# EAGLE design IV-18_test (EAGLE 6.6.0)
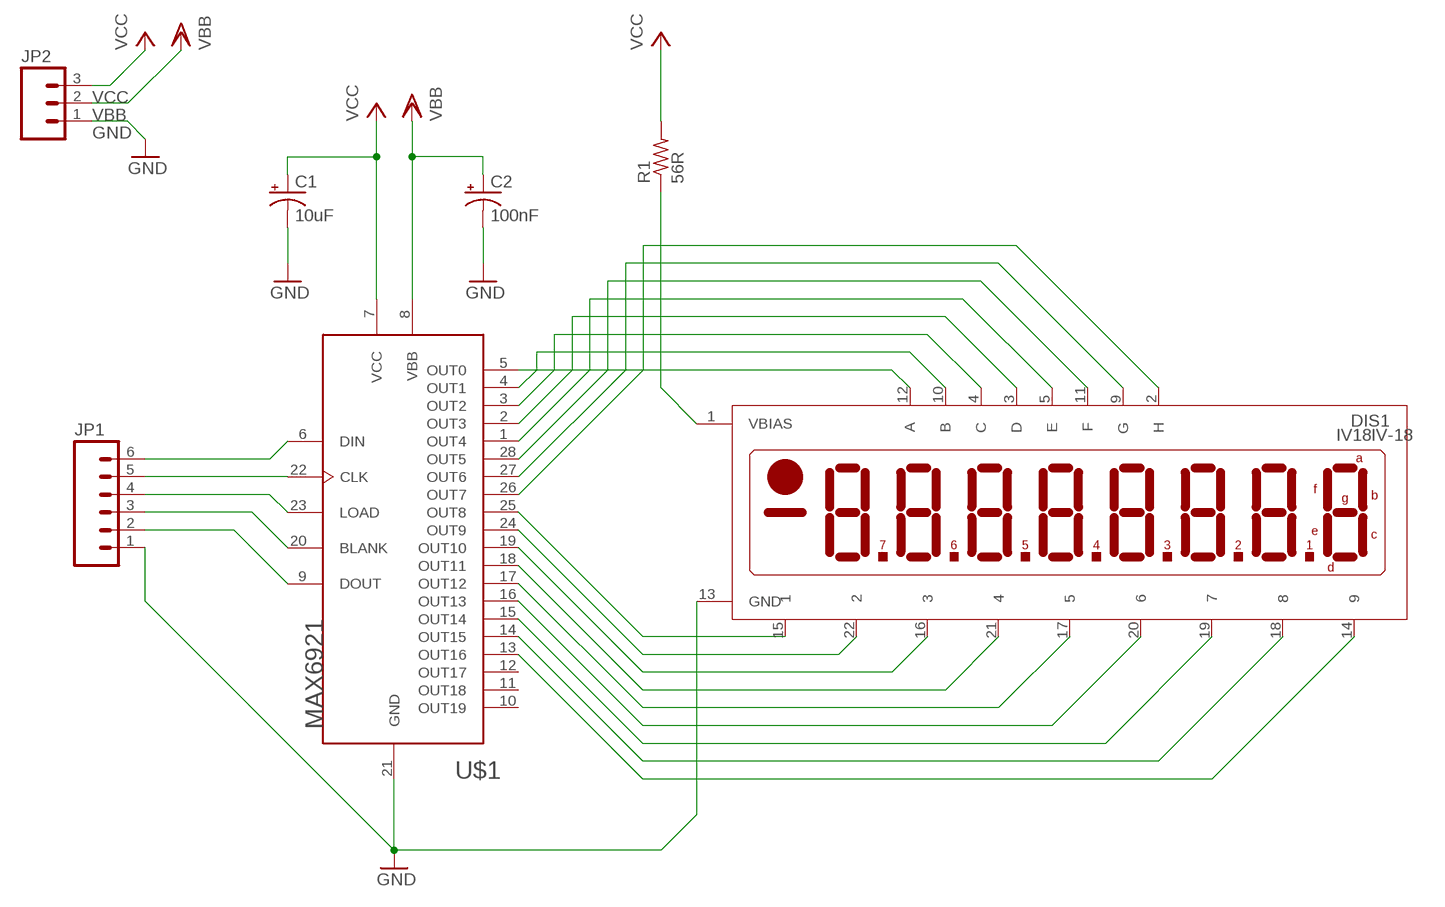
[diagram p0: schematic, sheet 1]

## Parts
C1  10uF  CPOL-USE2-5  [E2-5]
C2  100nF  CPOL-USE2-5  [E2-5]
DIS1  IV18IV-18  [IV-18]
JP1  M06SIP  [1X06]
JP2  M03PTH  [1X03]
R1  56R  R-US_0207/10  [0207/10]
U$1  MAX6921AUI  MAX6921AUI"  [TSSOP28]

## Nets
GND: C1.- C2.- DIS1.13(GND) JP1.1 JP2.1 U$1.21(GND)
N$1: DIS1.12(A) U$1.5(OUT0)
N$2: DIS1.10(B) U$1.4(OUT1)
N$3: DIS1.4(C) U$1.3(OUT2)
N$4: DIS1.3(D) U$1.2(OUT3)
N$5: DIS1.5(E) U$1.1(OUT4)
N$6: DIS1.11(F) U$1.28(OUT5)
N$7: DIS1.9(G) U$1.27(OUT6)
N$8: DIS1.2(H) U$1.26(OUT7)
N$9: DIS1.15 U$1.25(OUT8)
N$10: DIS1.22 U$1.24(OUT9)
N$11: DIS1.16 U$1.19(OUT10)
N$12: DIS1.21 U$1.18(OUT11)
N$13: DIS1.17 U$1.17(OUT12)
N$14: DIS1.20 U$1.16(OUT13)
N$15: DIS1.19 U$1.15(OUT14)
N$16: DIS1.18 U$1.14(OUT15)
N$17: DIS1.14 U$1.13(OUT16)
N$18: JP1.6 U$1.6(DIN)
N$19: JP1.5 U$1.22(CLK)
N$20: JP1.4 U$1.23(LOAD)
N$21: JP1.3 U$1.20(BLANK)
N$22: JP1.2 U$1.9(DOUT)
VBB: C2.+ JP2.2 U$1.8(VBB)
VBIAS: DIS1.1(VBIAS) R1.1
VCC: C1.+ JP2.3 R1.2 U$1.7(VCC)
Unconnected: U$1.10(OUT19) U$1.11(OUT18) U$1.12(OUT17)

## Library data of the parts
C1 C2 = iStivi - RCLD:CPOL-US: POLARIZED CAPACITOR, American symbol
DIS1 = iStivi - Tubes:IV18: VFD Display 8-character 7 segment
JP1 = iStivi - Header-Connector:M06: Header 6 Standard 6-pin 0.1" header. Use with straight break away headers (SKU : PRT-00116), right angle break away headers (PRT-00553), swiss pins (PRT-00743), machine pins (PRT-00117), and female headers (PRT-00115). Molex polarized connector foot print use with SKU : PRT-08094 with associated crimp pins and housings. NOTES ON THE VARIANTS LOCK and LOCK_LONGPADS... This footprint was designed to help hold the alignment of a through-hole component (i.e. 6-pin header) while soldering it into place. You may notice that each hole has been shifted either up or down by 0.005 of an inch from it's more standard position (which is a perfectly straight line). This slight alteration caused the pins (the squares in the middle) to touch the edges of the holes. Because they are alternating, it causes a "brace" to hold the component in place. 0.005 has proven to be the perfect amount of "off-center" position when using our standard breakaway headers. Although looks a little odd when you look at the bare footprint, once you have a header in there, the alteration is very hard to notice. Also, if you push a header all the way into place, it is covered up entirely on the bottom side. This idea of altering the position of holes to aid alignment will be further integrated into the Sparkfun Library for other footprints. It can help hold any component with 3 or more connection pins.
JP2 = iStivi - Header-Connector:M03: Header 3 Standard 3-pin 0.1" header. Use with straight break away headers (SKU : PRT-00116), right angle break away headers (PRT-00553), swiss pins (PRT-00743), machine pins (PRT-00117), and female headers (PRT-00115). Molex polarized connector foot print use with SKU : PRT-08232 with associated crimp pins and housings.
R1 = iStivi - RCLD:R-US_: RESISTOR, American symbol
U$1 = iStivi - ICs:MAX6921: MAX6921 76V VFD driver in TSSOP and PLCC. Can be cascaded, talk to it via SPI

## Board
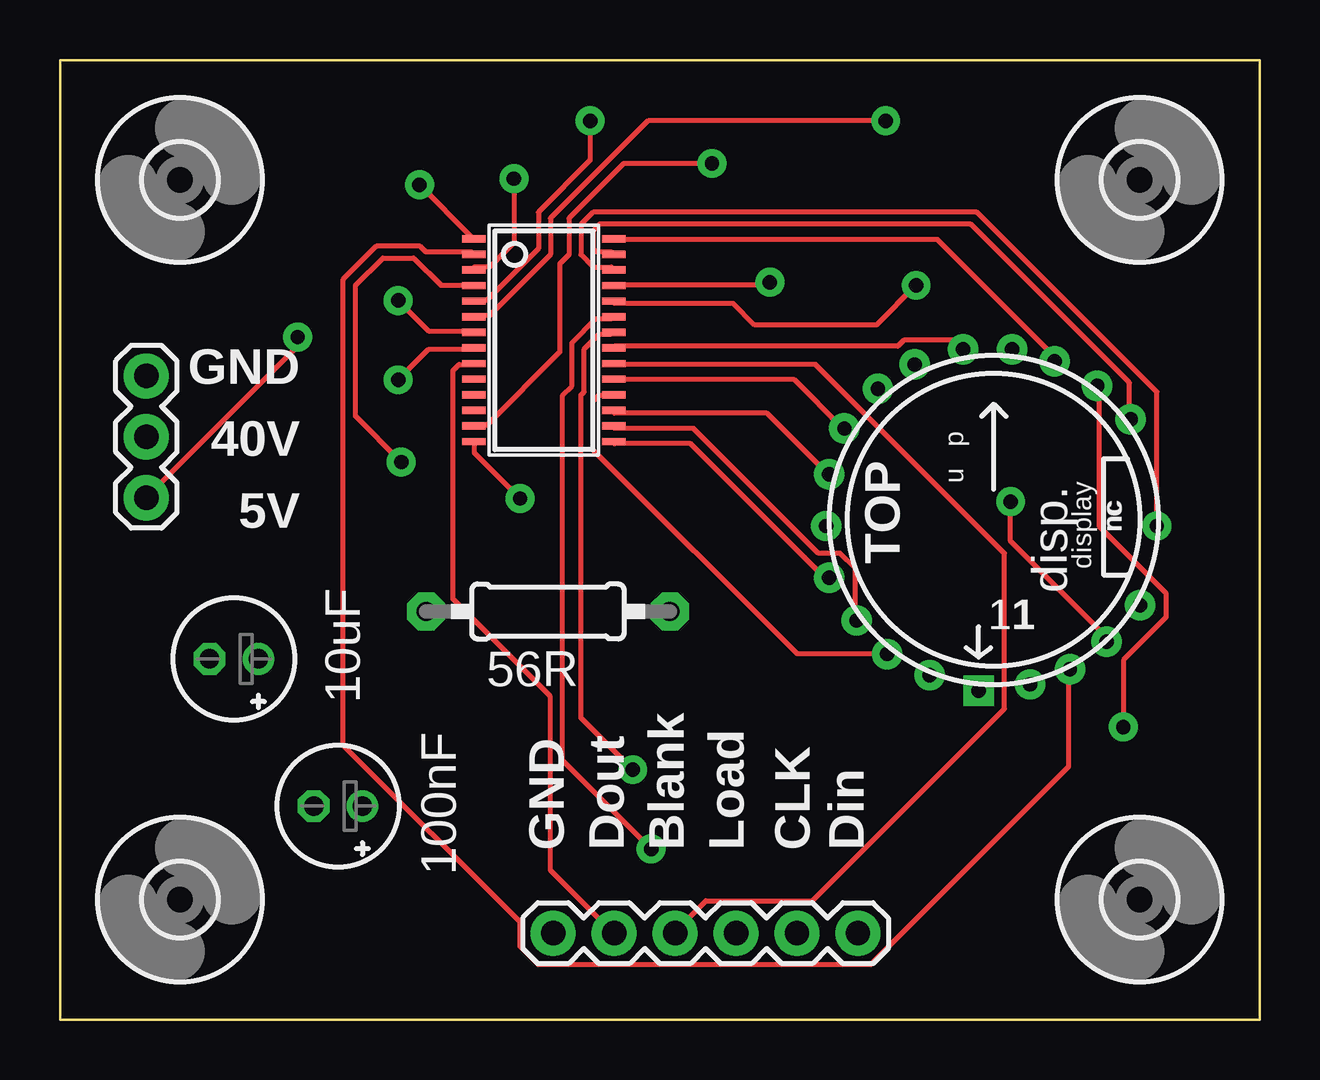
[diagram p1: board, top side]
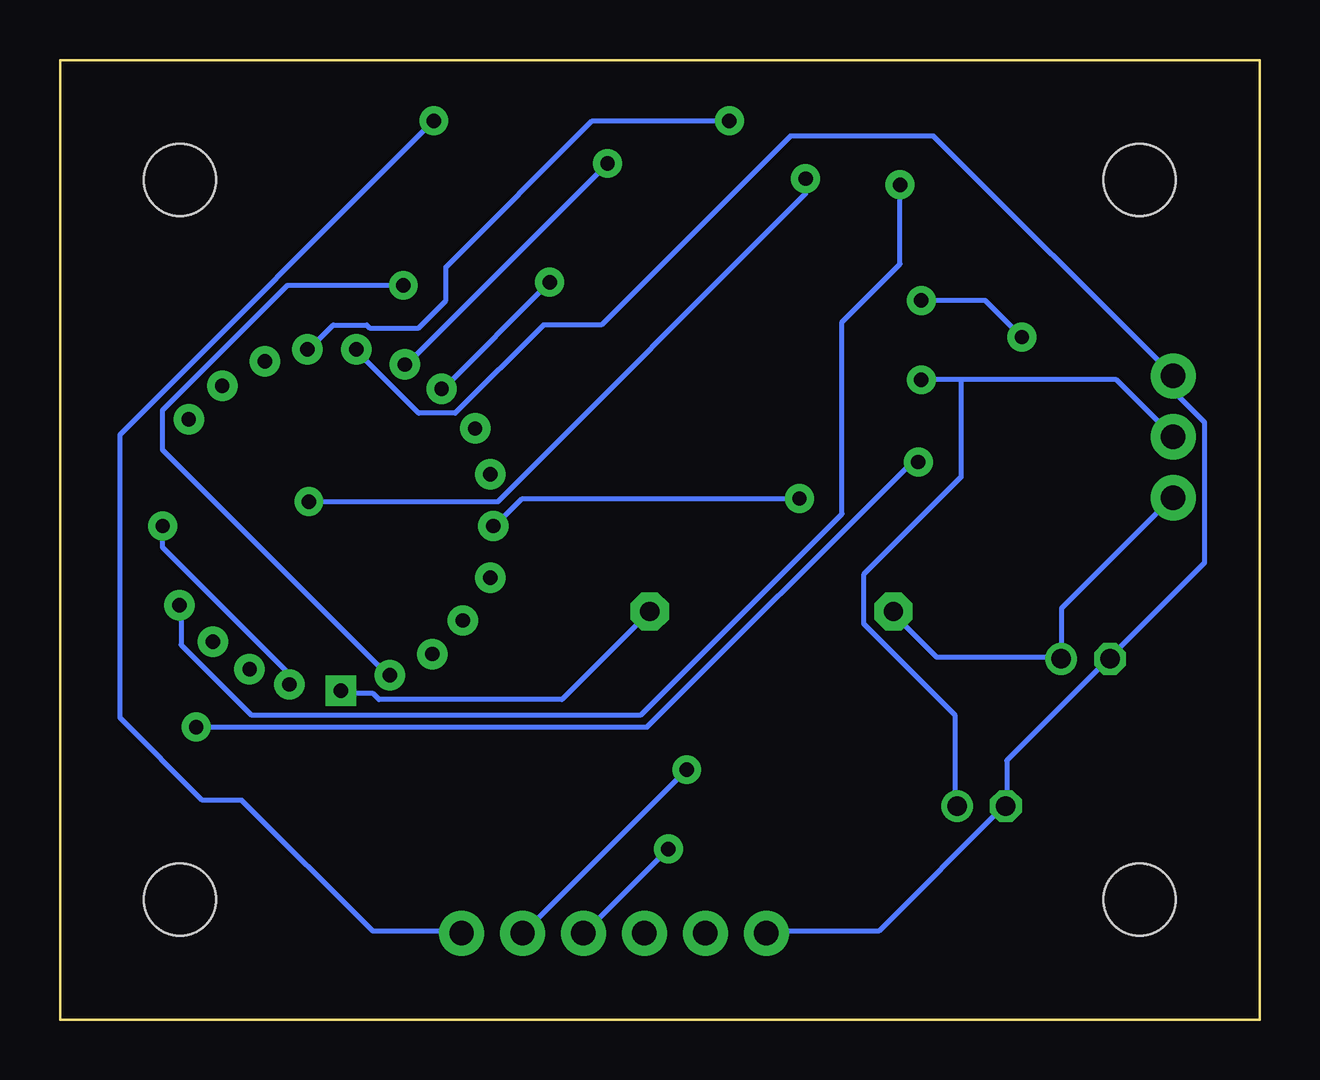
[diagram p2: board, bottom side, seen from below]

Size 50 x 40 mm. Coordinates in mm from the lower left corner, seen from the top.
Outline: 0,0 50,0 50,40 0,40 0,0
Copper layers (1*16): Top 0.035mm / dielectric 1.5mm / Bottom 0.035mm
Design rules "iStivi *": minimum track width 8mil, minimum drill 0.6mm, track to track 10mil, track to pad 10mil, pad to pad 10mil, via to via 2mm, smd to smd 10mil, copper to edge 40mil, drill to drill 8mil, minimum pad ring 10mil, minimum via ring 10mil, stop-mask expansion 0mil, vias tented up to drill 0mil, thermal gap 10mil

### Footprints (pad centres in the part's own frame; a part is rotated, then mirrored left to right if it is on the bottom)
E2-5 = drill 0.813 pad 1.27: + -1.016,0 | drill 0.813 pad 1.27 octagon: - 1.016,0
IV-18 = drill 0.6 pad 1.27 square: 1 -0.635,-7.112 | drill 0.6 pad 1.27: 2 1.524,-6.858; 3 3.175,-6.223; 4 4.699,-5.08; 5 6.096,-3.556; 9 5.715,4.191; 10 4.318,5.588; 11 2.54,6.604; 12 0.762,7.112; 13 -1.27,7.112; 14 -3.302,6.477; 15 -4.826,5.461; 16 -6.223,3.81; 17 -6.858,1.905; 18 -6.985,-0.254; 19 -6.858,-2.413; 20 -5.715,-4.191; 21 -4.445,-5.588; 22 -2.667,-6.477
1X06 = drill 1.016 pad 1.88: 1 0,0; 2 2.54,0; 3 5.08,0; 4 7.62,0; 5 10.16,0; 6 12.7,0
1X03 = drill 1.016 pad 1.88: 1 0,0; 2 2.54,0; 3 5.08,0
0207/10 = drill 0.8 pad 1.6 octagon: 1 -5.08,0; 2 5.08,0
TSSOP28 = smd 0.305 x 0.991: 1 -4.225,-2.918; 2 -3.575,-2.918; 3 -2.925,-2.918; 4 -2.275,-2.918; 5 -1.625,-2.918; 6 -0.975,-2.918; 7 -0.325,-2.918; 8 0.325,-2.918; 9 0.975,-2.918; 10 1.625,-2.918; 11 2.275,-2.918; 12 2.925,-2.918; 13 3.575,-2.918; 14 4.225,-2.918; 15 4.225,2.918; 16 3.575,2.918; 17 2.925,2.918; 18 2.275,2.918; 19 1.625,2.918; 20 0.975,2.918; 21 0.325,2.918; 22 -0.325,2.918; 23 -0.975,2.918; 24 -1.625,2.918; 25 -2.275,2.918; 26 -2.925,2.918; 27 -3.575,2.918; 28 -4.225,2.918
3,0 = hole 3: 0,0

### Placement (x,y rotation side)
C1  7.25,15.04 180 top
C2  11.59,8.9 180 top
DIS1  38.92,20.83 0 top
JP1  20.56,3.6 0 top
JP2  3.6,26.83 270 top
R1  20.34,17.01 180 top
U$1  20.17,28.32 270 top
U$4  [3,0]  5,35 0 top
U$5  [3,0]  45,35 0 top
U$6  [3,0]  5,5 0 top
U$7  [3,0]  45,5 0 top

### Tracks (layer width: path | path; a pad name or v marks a point on that pad's centre or on a via)
GND
  Top 0.203: U$1.21 23.11,28.07 34.92,28.07 35.18,28.32 37.21,28.32 37.59,27.94 DIS1.13
  Bottom 0.203: JP1.1 20.45,3.68 15.88,3.68 10.67,8.89 C2.- 10.54,9.02 10.54,10.79 6.35,14.99 C1.- 6.22,15.11 2.29,19.05 2.29,24.89 3.56,26.16 3.56,26.8 JP2.1 3.68,26.92 13.59,36.83 19.56,36.83 27.43,28.96 29.84,28.96 33.53,25.27 35.05,25.27 37.59,27.81 DIS1.13
N$1  (via drill 0.6)
  Top 0.203: v22.1,37.47 22.1,35.81 19.94,33.66 19.94,32.13 17.78,29.97 17.27,29.97 U$1.5
  Bottom 0.203: v22.1,37.47 27.81,37.47 33.91,31.37 33.91,29.97 35.05,28.83 37.08,28.83 37.21,28.96 38.61,28.96 39.62,27.94 DIS1.12
N$2  (via drill 0.6)
  Top 0.203: v14.22,23.24 12.32,25.15 12.32,30.61 13.46,31.75 14.73,31.75 15.88,30.61 17.14,30.61 U$1.4 | v44.32,12.19 44.32,14.99 46.1,16.76 46.1,17.78 43.31,20.57 43.31,26.29 DIS1.10
  Bottom 0.203: v14.22,23.24 14.48,23.24 25.53,12.19 v44.32,12.19
N$3  (via drill 0.6)
  Top 0.203: v18.92,35.05 18.92,32.38 17.91,31.37 17.27,31.37 U$1.3 | v39.62,21.59 39.62,19.94 43.56,16 43.56,15.75 DIS1.4
  Bottom 0.203: v18.92,35.05 18.92,34.42 31.75,21.59 v39.62,21.59
N$4
  Top 0.203: U$1.2 17.14,32 15.24,32 14.99,32.26 13.21,32.26 11.81,30.86 11.81,11.43 19.18,4.06 19.18,3.05 19.94,2.29 33.78,2.29 42.04,10.54 42.04,14.48 DIS1.3
N$5  (via drill 0.6)
  Top 0.203: v14.99,34.8 17.14,32.64 U$1.1
  Bottom 0.203: v14.99,34.8 14.99,31.5 17.4,29.08 17.4,21.08 25.78,12.7 42.04,12.7 44.96,15.62 44.96,17.14 DIS1.5
N$6
  Top 0.203: U$1.28 23.11,32.51 36.58,32.51 41.4,27.69 41.4,27.43 DIS1.11
N$7
  Top 0.203: U$1.27 22.99,32 22.35,32 22.23,32.13 22.23,32.89 22.48,33.15 37.97,33.15 44.58,26.54 44.58,25.02 DIS1.9
N$8  (via drill 0.6)
  Top 0.203: v45.72,20.57 45.72,26.16 38.23,33.66 22.23,33.66 21.72,33.15 21.72,31.88 22.23,31.37 22.99,31.37 U$1.26
  Bottom 0.203: v45.72,20.57 45.72,19.68 40.51,14.48 40.51,13.97 DIS1.2
N$9  (via drill 0.6)
  Top 0.203: v29.59,30.73 29.46,30.61 23.11,30.61 U$1.25
  Bottom 0.203: v29.59,30.73 34.04,26.29 DIS1.15
N$10  (via drill 0.6)
  Top 0.203: v35.69,30.61 34.04,28.96 28.96,28.96 28.07,29.84 23.11,29.84 U$1.24
  Bottom 0.203: v35.69,30.61 40.51,30.61 45.72,25.4 45.72,23.75 36.32,14.35 DIS1.22
N$11
  Top 0.203: U$1.19 23.11,26.67 30.61,26.67 32.64,24.64 DIS1.16
N$12
  Top 0.203: U$1.18 22.99,26.04 22.48,26.04 22.23,25.78 22.23,23.75 30.73,15.24 34.42,15.24 DIS1.21
N$13
  Top 0.203: U$1.17 23.11,25.27 29.46,25.27 32,22.73 DIS1.17
N$14
  Top 0.203: U$1.16 23.11,24.64 26.42,24.64 31.62,19.43 32.51,19.43 33.15,18.8 33.15,16.64 DIS1.20
N$15
  Top 0.203: U$1.15 23.11,24 26.29,24 32,18.29 DIS1.19
N$16  (via drill 0.6)
  Top 0.203: v19.18,21.72 17.27,23.62 17.27,24 U$1.14
  Bottom 0.203: v19.18,21.72 30.73,21.72 31.88,20.57 DIS1.18
N$17  (via drill 0.6)
  Top 0.203: v27.18,35.69 23.5,35.69 21.21,33.4 21.21,31.88 20.83,31.5 20.83,27.81 17.78,24.77 17.27,24.77 U$1.13
  Bottom 0.203: v27.18,35.69 35.56,27.3 DIS1.14
N$18  (via drill 0.6)
  Top 0.203: v34.42,37.47 24.51,37.47 20.45,33.4 20.45,31.88 17.91,29.34 17.27,29.34 U$1.6
  Bottom 0.203: v34.42,37.47 47.5,24.38 47.5,12.57 44.07,9.14 42.42,9.14 36.96,3.68 33.27,3.68 JP1.6
N$19  (via drill 0.6)
  Top 0.203: v23.88,10.41 21.72,12.57 21.72,26.04 21.84,26.16 21.84,27.94 22.48,28.57 22.99,28.57 U$1.22
  Bottom 0.203: v23.88,10.41 30.61,3.68 JP1.5
N$20  (via drill 0.6)
  Top 0.203: v24.64,7.11 20.95,10.79 20.95,26.04 21.34,26.42 21.34,28.19 22.35,29.21 22.99,29.21 U$1.23
  Bottom 0.203: v24.64,7.11 28.07,3.68 JP1.4
N$21
  Top 0.203: U$1.20 23.11,27.3 31.5,27.3 39.37,19.43 39.37,12.95 31.37,4.95 26.92,4.95 25.65,3.68 JP1.3
N$22
  Top 0.203: U$1.9 17.14,27.3 16.64,27.3 16.38,27.05 16.38,17.53 20.45,13.46 20.45,6.22 22.99,3.68 JP1.2
VBB  (via drill 0.6)
  Top 0.203: v14.1,26.67 15.37,27.94 17.14,27.94 U$1.8
  Bottom 0.203: 12.45,26.67 5.97,26.67 3.68,24.38 JP2.2 | 12.45,26.67 v14.1,26.67 | 12.45,26.67 12.45,22.61 16.51,18.54 16.51,16.51 12.7,12.7 12.7,9.02 C2.+
VBIAS
  Bottom 0.203: DIS1.1 38.23,13.59 36.96,13.59 36.7,13.34 29.08,13.34 25.53,16.89 R1.1
VCC  (via drill 0.6)
  Top 0.203: v14.1,29.97 15.37,28.7 17.14,28.7 U$1.7 | v9.91,28.45 9.91,28.07 3.68,21.84 JP2.3
  Bottom 0.203: R1.2 15.24,16.89 13.46,15.11 8.38,15.11 C1.+ 8.26,15.11 8.26,17.14 3.68,21.72 JP2.3 | v14.1,29.97 11.43,29.97 v9.91,28.45

### Text on the board
_tplace: GND | 40V | 5V | nc | TOP | disp. | 1 | GND | Dout | Blank | Load | CLK | Din